# Altium schematic sheet IC_LPDDR4.SchDoc
size 420 x 297 mm; Title1str: Модуль; PageSetup: Record=PageOptions|CenterHorizontal=False|CenterVertical=False|PrintScale=0.95|XCorrection=0.00|YCorrection=0.00|PrintKind=1|BorderSize=5000000|LeftOffset=0|BottomOffset=0|Orientation=1|PaperLength=1000|PaperWidth=1000|Scale=100|PaperSource=15|PrintQuality=600|MediaType=1|DitherType=10|PaperKind=A4|PrintScaleMode=1; Title2str: ATB-LW-USB-GateWay; Mass: ---; Letter1Column: О; Letter2Column: {L}; DocumentType1str: {Документ}; DocumentType2str: {Документ}; SpravNomer: {Справ. №}; Scale: 1:1; DocumentType: Схема электрическая принципиальная; SheetNumber: 13; SheetTotal: 32; DocumentTypeShort: Э3; DocumentInvertoryNumber: ㅤ
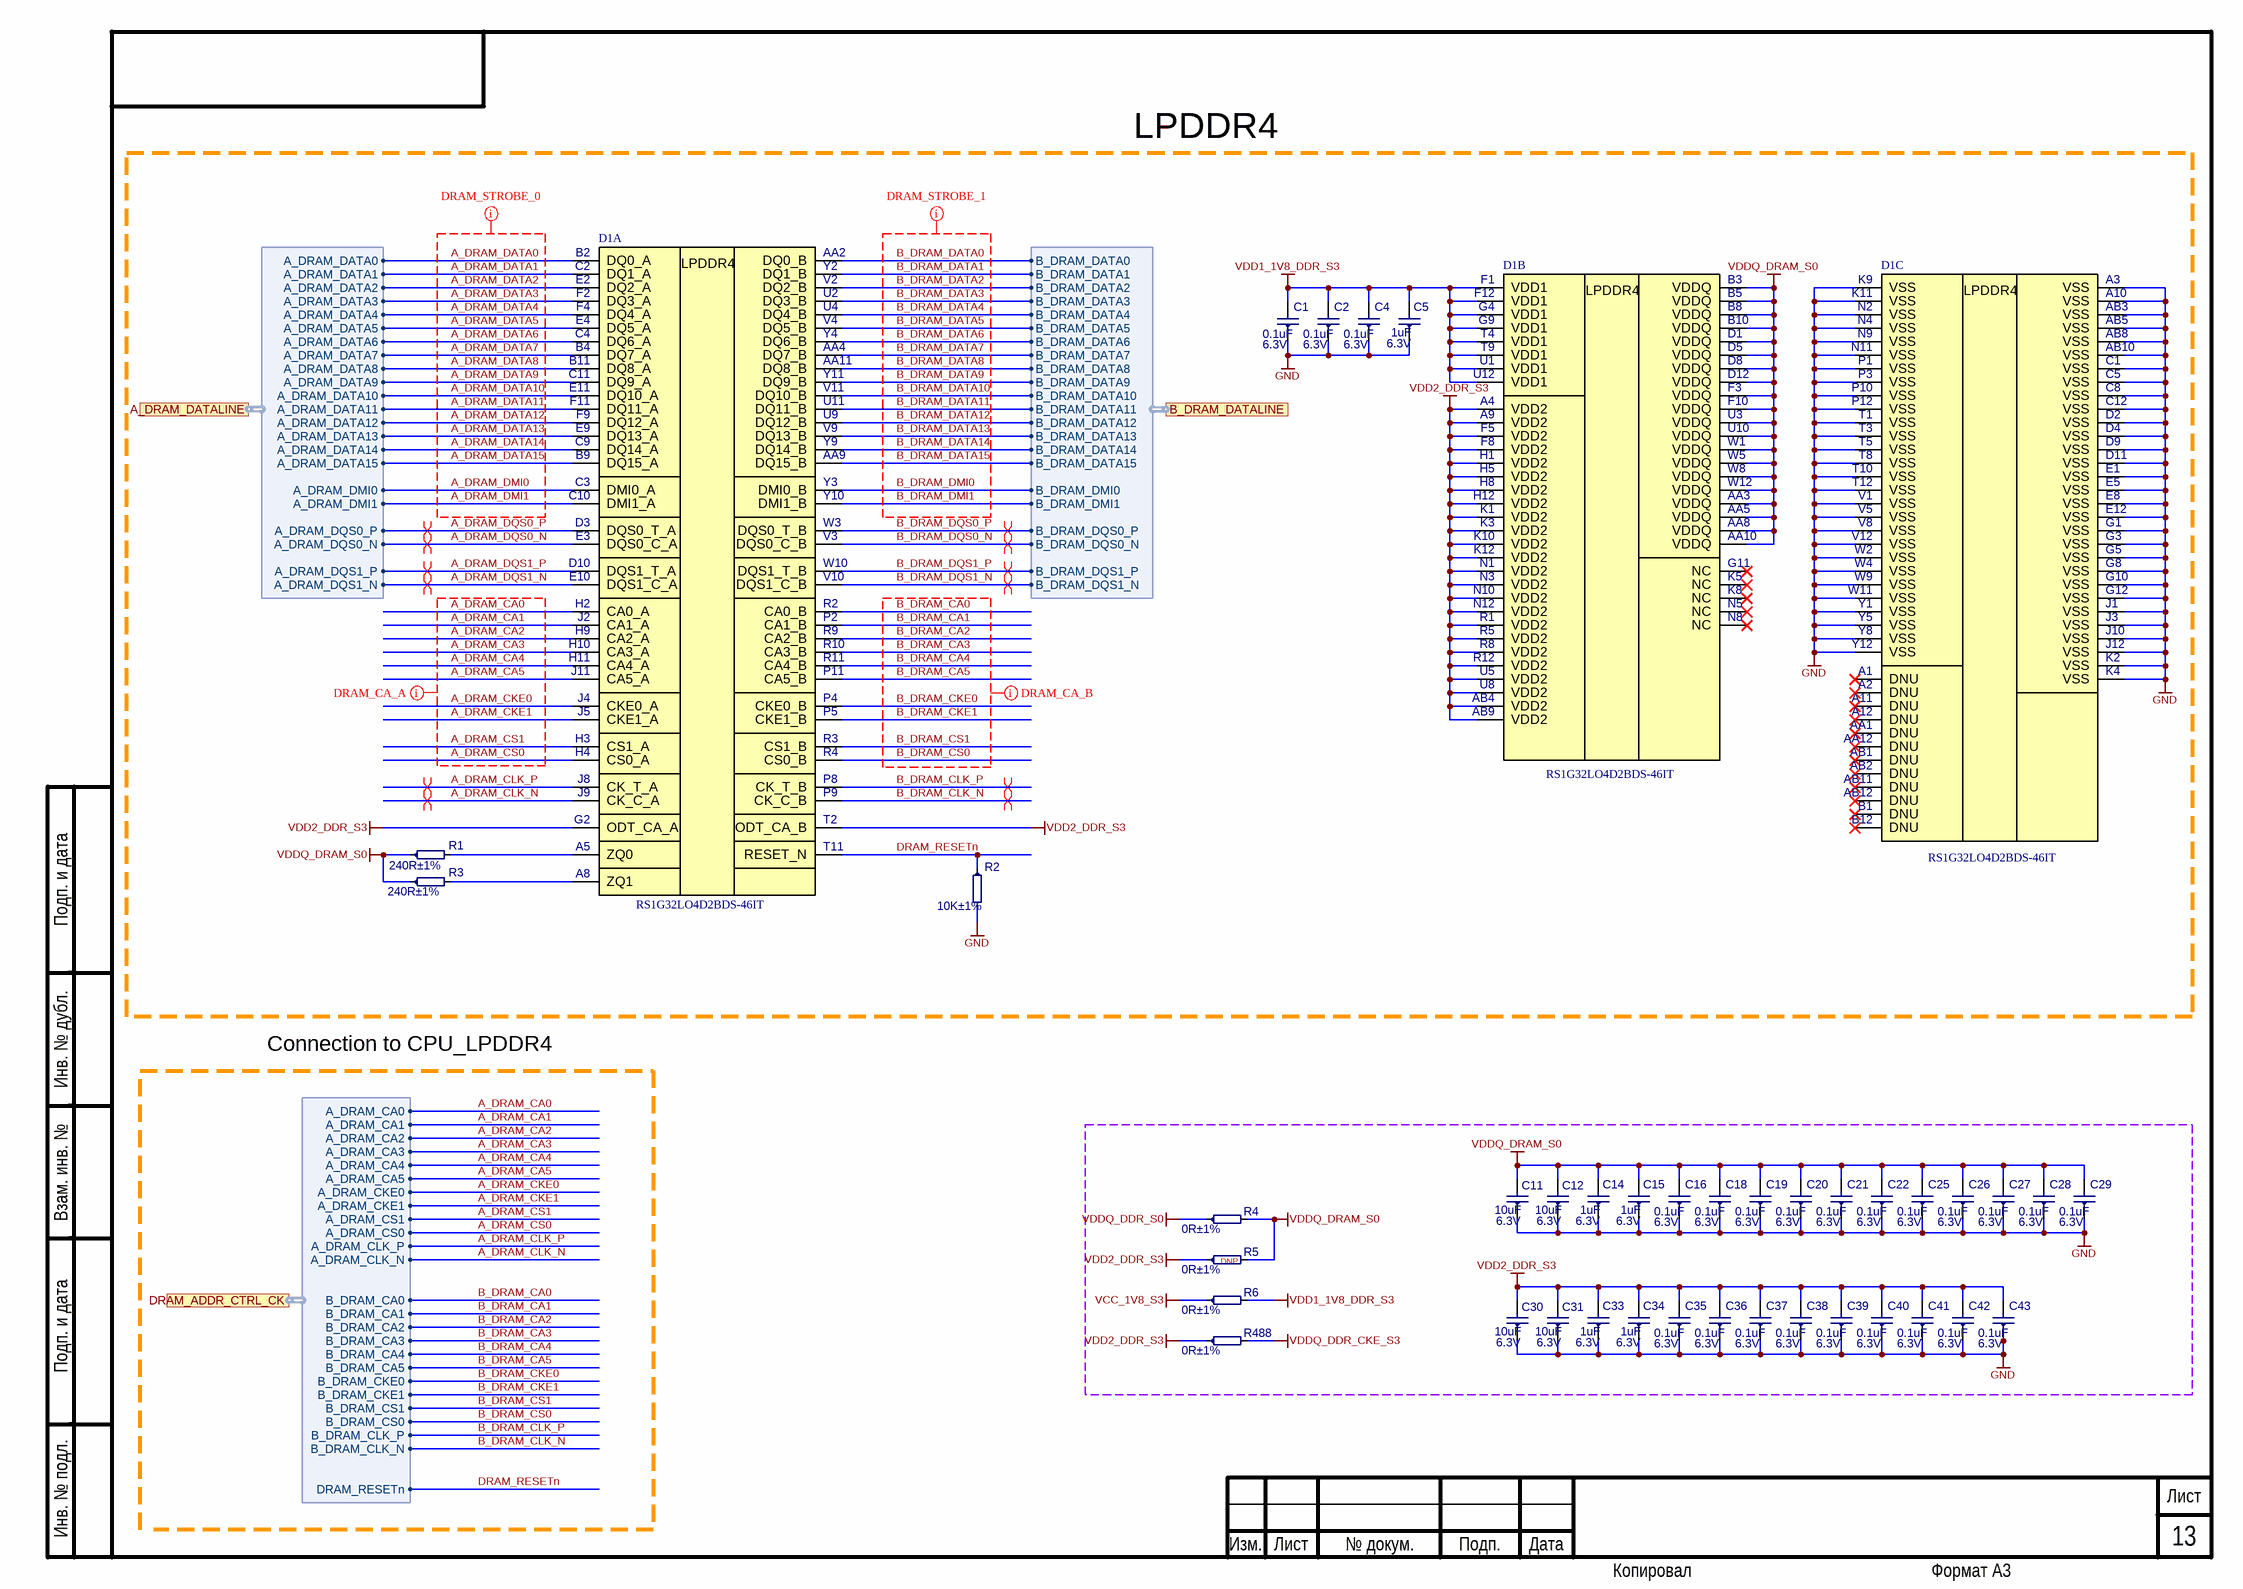
[diagram p0: IC_LPDDR4.SchDoc]

## Parts
C1  0.1uF  Voltage: 6.3V  [C0201]
C2  0.1uF  Voltage: 6.3V  [C0201]
C4  0.1uF  Voltage: 6.3V  [C0201]
C5  1uF  Voltage: 6.3V  [C0201]
C11  10uF  Voltage: 6.3V  [C0402]
C12  10uF  Voltage: 6.3V  [C0402]
C14  1uF  Voltage: 6.3V  [C0201]
C15  1uF  Voltage: 6.3V  [C0201]
C16  0.1uF  Voltage: 6.3V  [C0201]
C18  0.1uF  Voltage: 6.3V  [C0201]
C19  0.1uF  Voltage: 6.3V  [C0201]
C20  0.1uF  Voltage: 6.3V  [C0201]
C21  0.1uF  Voltage: 6.3V  [C0201]
C22  0.1uF  Voltage: 6.3V  [C0201]
C25  0.1uF  Voltage: 6.3V  [C0201]
C26  0.1uF  Voltage: 6.3V  [C0201]
C27  0.1uF  Voltage: 6.3V  [C0201]
C28  0.1uF  Voltage: 6.3V  [C0201]
C29  0.1uF  Voltage: 6.3V  [C0201]
C30  10uF  Voltage: 6.3V  [C0402]
C31  10uF  Voltage: 6.3V  [C0402]
C33  1uF  Voltage: 6.3V  [C0201]
C34  1uF  Voltage: 6.3V  [C0201]
C35  0.1uF  Voltage: 6.3V  [C0201]
C36  0.1uF  Voltage: 6.3V  [C0201]
C37  0.1uF  Voltage: 6.3V  [C0201]
C38  0.1uF  Voltage: 6.3V  [C0201]
C39  0.1uF  Voltage: 6.3V  [C0201]
C40  0.1uF  Voltage: 6.3V  [C0201]
C41  0.1uF  Voltage: 6.3V  [C0201]
C42  0.1uF  Voltage: 6.3V  [C0201]
C43  0.1uF  Voltage: 6.3V  [C0201]
D1  RS1G32LO4D2BDS-46IT  [RS1G32LO4D2BDS-46IT]  (parts A,B,C of 3)
R1  240R±1%  [R0402]
R2  10K±1%  [R0402]
R3  240R±1%  [R0402]
R4  0R±1%  [R0402]
R5  0R±1%  [R0402]
R6  0R±1%  [R0402]
R488  0R±1%  [R0402]

## Ports
A_DRAM_DATALINE (harness A_DRAM_DATALINE), B_DRAM_DATALINE (harness B_DRAM_DATALINE), DRAM_ADDR_CTRL_CK (harness DRAM_ADDR_CTRL_CK)

## Harnesses
A_DRAM_DATALINE: A_DRAM_DATA0, A_DRAM_DATA1, A_DRAM_DATA2, A_DRAM_DATA3, A_DRAM_DATA4, A_DRAM_DATA5, A_DRAM_DATA6, A_DRAM_DATA7, A_DRAM_DATA8, A_DRAM_DATA9, A_DRAM_DATA10, A_DRAM_DATA11, A_DRAM_DATA12, A_DRAM_DATA13, A_DRAM_DATA15, A_DRAM_DATA14, A_DRAM_DMI0, A_DRAM_DMI1, A_DRAM_DQS0_P, A_DRAM_DQS0_N, A_DRAM_DQS1_P, A_DRAM_DQS1_N
B_DRAM_DATALINE: B_DRAM_DATA0, B_DRAM_DATA1, B_DRAM_DATA2, B_DRAM_DATA3, B_DRAM_DATA4, B_DRAM_DATA5, B_DRAM_DATA6, B_DRAM_DATA7, B_DRAM_DATA8, B_DRAM_DATA9, B_DRAM_DATA10, B_DRAM_DATA11, B_DRAM_DATA12, B_DRAM_DATA13, B_DRAM_DATA15, B_DRAM_DATA14, B_DRAM_DMI1, B_DRAM_DMI0, B_DRAM_DQS0_P, B_DRAM_DQS0_N, B_DRAM_DQS1_N, B_DRAM_DQS1_P
DRAM_ADDR_CTRL_CK: B_DRAM_CKE0, B_DRAM_CKE1, B_DRAM_CLK_P, B_DRAM_CS1, A_DRAM_CLK_P, B_DRAM_CA5, A_DRAM_CLK_N, B_DRAM_CA1, B_DRAM_CLK_N, B_DRAM_CA0, B_DRAM_CA2, DRAM_RESETn, B_DRAM_CA3, A_DRAM_CKE1, A_DRAM_CS1, A_DRAM_CA3, A_DRAM_CA5, A_DRAM_CA0, A_DRAM_CS0, A_DRAM_CKE0, A_DRAM_CA4, A_DRAM_CA2, A_DRAM_CA1, B_DRAM_CA4, B_DRAM_CS0

## Nets
GND: C1.1 C2.1 C4.1 C5.1 C11.1 C12.1 C14.1 C15.1 C16.1 C18.1 C19.1 C20.1 C21.1 C22.1 C25.1 C26.1 C27.1 C28.1 C29.1 C30.1 C31.1 C33.1 C34.1 C35.1 C36.1 C37.1 C38.1 C39.1 C40.1 C41.1 C42.1 C43.1 D1.A3(VSS) D1.A10(VSS) D1.AB3(VSS) D1.AB5(VSS) D1.AB8(VSS) D1.AB10(VSS) D1.C1(VSS) D1.C5(VSS) D1.C8(VSS) D1.C12(VSS) D1.D2(VSS) D1.D4(VSS) D1.D9(VSS) D1.D11(VSS) D1.E1(VSS) D1.E5(VSS) D1.E8(VSS) D1.E12(VSS) D1.G1(VSS) D1.G3(VSS) D1.G5(VSS) D1.G8(VSS) D1.G10(VSS) D1.G12(VSS) D1.J1(VSS) D1.J3(VSS) D1.J10(VSS) D1.J12(VSS) D1.K2(VSS) D1.K4(VSS) D1.K9(VSS) D1.K11(VSS) D1.N2(VSS) D1.N4(VSS) D1.N9(VSS) D1.N11(VSS) D1.P1(VSS) D1.P3(VSS) D1.P10(VSS) D1.P12(VSS) D1.T1(VSS) D1.T3(VSS) D1.T5(VSS) D1.T8(VSS) D1.T10(VSS) D1.T12(VSS) D1.V1(VSS) D1.V5(VSS) D1.V8(VSS) D1.V12(VSS) D1.W2(VSS) D1.W4(VSS) D1.W9(VSS) D1.W11(VSS) D1.Y1(VSS) D1.Y5(VSS) D1.Y8(VSS) D1.Y12(VSS) R2.2
VCC_1V8_S3: R6.1
VDD1_1V8_DDR_S3: C1.2 C2.2 C4.2 C5.2 D1.F1(VDD1) D1.F12(VDD1) D1.G4(VDD1) D1.G9(VDD1) D1.T4(VDD1) D1.T9(VDD1) D1.U1(VDD1) D1.U12(VDD1) R6.2
VDD2_DDR_S3: C30.2 C31.2 C33.2 C34.2 C35.2 C36.2 C37.2 C38.2 C39.2 C40.2 C41.2 C42.2 C43.2 D1.A4(VDD2) D1.A9(VDD2) D1.AB4(VDD2) D1.AB9(VDD2) D1.F5(VDD2) D1.F8(VDD2) D1.G2(ODT_CA_A) D1.H1(VDD2) D1.H5(VDD2) D1.H8(VDD2) D1.H12(VDD2) D1.K1(VDD2) D1.K3(VDD2) D1.K10(VDD2) D1.K12(VDD2) D1.N1(VDD2) D1.N3(VDD2) D1.N10(VDD2) D1.N12(VDD2) D1.R1(VDD2) D1.R5(VDD2) D1.R8(VDD2) D1.R12(VDD2) D1.T2(ODT_CA_B) D1.U5(VDD2) D1.U8(VDD2) R5.1 R488.1
VDDQ_DDR_CKE_S3: R488.2
VDDQ_DDR_S0: R4.1
VDDQ_DRAM_S0: C11.2 C12.2 C14.2 C15.2 C16.2 C18.2 C19.2 C20.2 C21.2 C22.2 C25.2 C26.2 C27.2 C28.2 C29.2 D1.AA3(VDDQ) D1.AA5(VDDQ) D1.AA8(VDDQ) D1.AA10(VDDQ) D1.B3(VDDQ) D1.B5(VDDQ) D1.B8(VDDQ) D1.B10(VDDQ) D1.D1(VDDQ) D1.D5(VDDQ) D1.D8(VDDQ) D1.D12(VDDQ) D1.F3(VDDQ) D1.F10(VDDQ) D1.U3(VDDQ) D1.U10(VDDQ) D1.W1(VDDQ) D1.W5(VDDQ) D1.W8(VDDQ) D1.W12(VDDQ) R1.1 R3.1 R4.2 R5.2
A_DRAM_CA0: D1.H2(CA0_A) ; port DRAM_ADDR_CTRL_CK.A_DRAM_CA0
A_DRAM_CA1: D1.J2(CA1_A) ; port DRAM_ADDR_CTRL_CK.A_DRAM_CA1
A_DRAM_CA2: D1.H9(CA2_A) ; port DRAM_ADDR_CTRL_CK.A_DRAM_CA2
A_DRAM_CA3: D1.H10(CA3_A) ; port DRAM_ADDR_CTRL_CK.A_DRAM_CA3
A_DRAM_CA4: D1.H11(CA4_A) ; port DRAM_ADDR_CTRL_CK.A_DRAM_CA4
A_DRAM_CA5: D1.J11(CA5_A) ; port DRAM_ADDR_CTRL_CK.A_DRAM_CA5
A_DRAM_CKE0: D1.J4(CKE0_A) ; port DRAM_ADDR_CTRL_CK.A_DRAM_CKE0
A_DRAM_CKE1: D1.J5(CKE1_A) ; port DRAM_ADDR_CTRL_CK.A_DRAM_CKE1
A_DRAM_CLK_N: D1.J9(CK_C_A) ; port DRAM_ADDR_CTRL_CK.A_DRAM_CLK_N
A_DRAM_CLK_P: D1.J8(CK_T_A) ; port DRAM_ADDR_CTRL_CK.A_DRAM_CLK_P
A_DRAM_CS0: D1.H4(CS0_A) ; port DRAM_ADDR_CTRL_CK.A_DRAM_CS0
A_DRAM_CS1: D1.H3(CS1_A) ; port DRAM_ADDR_CTRL_CK.A_DRAM_CS1
A_DRAM_DATA0: D1.B2(DQ0_A) ; port A_DRAM_DATALINE.A_DRAM_DATA0
A_DRAM_DATA1: D1.C2(DQ1_A) ; port A_DRAM_DATALINE.A_DRAM_DATA1
A_DRAM_DATA2: D1.E2(DQ2_A) ; port A_DRAM_DATALINE.A_DRAM_DATA2
A_DRAM_DATA3: D1.F2(DQ3_A) ; port A_DRAM_DATALINE.A_DRAM_DATA3
A_DRAM_DATA4: D1.F4(DQ4_A) ; port A_DRAM_DATALINE.A_DRAM_DATA4
A_DRAM_DATA5: D1.E4(DQ5_A) ; port A_DRAM_DATALINE.A_DRAM_DATA5
A_DRAM_DATA6: D1.C4(DQ6_A) ; port A_DRAM_DATALINE.A_DRAM_DATA6
A_DRAM_DATA7: D1.B4(DQ7_A) ; port A_DRAM_DATALINE.A_DRAM_DATA7
A_DRAM_DATA8: D1.B11(DQ8_A) ; port A_DRAM_DATALINE.A_DRAM_DATA8
A_DRAM_DATA9: D1.C11(DQ9_A) ; port A_DRAM_DATALINE.A_DRAM_DATA9
A_DRAM_DATA10: D1.E11(DQ10_A) ; port A_DRAM_DATALINE.A_DRAM_DATA10
A_DRAM_DATA11: D1.F11(DQ11_A) ; port A_DRAM_DATALINE.A_DRAM_DATA11
A_DRAM_DATA12: D1.F9(DQ12_A) ; port A_DRAM_DATALINE.A_DRAM_DATA12
A_DRAM_DATA13: D1.E9(DQ13_A) ; port A_DRAM_DATALINE.A_DRAM_DATA13
A_DRAM_DATA14: D1.C9(DQ14_A) ; port A_DRAM_DATALINE.A_DRAM_DATA14
A_DRAM_DATA15: D1.B9(DQ15_A) ; port A_DRAM_DATALINE.A_DRAM_DATA15
A_DRAM_DMI0: D1.C3(DMI0_A) ; port A_DRAM_DATALINE.A_DRAM_DMI0
A_DRAM_DMI1: D1.C10(DMI1_A) ; port A_DRAM_DATALINE.A_DRAM_DMI1
A_DRAM_DQS0_N: D1.E3(DQS0_C_A) ; port A_DRAM_DATALINE.A_DRAM_DQS0_N
A_DRAM_DQS0_P: D1.D3(DQS0_T_A) ; port A_DRAM_DATALINE.A_DRAM_DQS0_P
A_DRAM_DQS1_N: D1.E10(DQS1_C_A) ; port A_DRAM_DATALINE.A_DRAM_DQS1_N
A_DRAM_DQS1_P: D1.D10(DQS1_T_A) ; port A_DRAM_DATALINE.A_DRAM_DQS1_P
B_DRAM_CA0: D1.R2(CA0_B) ; port DRAM_ADDR_CTRL_CK.B_DRAM_CA0
B_DRAM_CA1: D1.P2(CA1_B) ; port DRAM_ADDR_CTRL_CK.B_DRAM_CA1
B_DRAM_CA2: D1.R9(CA2_B) ; port DRAM_ADDR_CTRL_CK.B_DRAM_CA2
B_DRAM_CA3: D1.R10(CA3_B) ; port DRAM_ADDR_CTRL_CK.B_DRAM_CA3
B_DRAM_CA4: D1.R11(CA4_B) ; port DRAM_ADDR_CTRL_CK.B_DRAM_CA4
B_DRAM_CA5: D1.P11(CA5_B) ; port DRAM_ADDR_CTRL_CK.B_DRAM_CA5
B_DRAM_CKE0: D1.P4(CKE0_B) ; port DRAM_ADDR_CTRL_CK.B_DRAM_CKE0
B_DRAM_CKE1: D1.P5(CKE1_B) ; port DRAM_ADDR_CTRL_CK.B_DRAM_CKE1
B_DRAM_CLK_N: D1.P9(CK_C_B) ; port DRAM_ADDR_CTRL_CK.B_DRAM_CLK_N
B_DRAM_CLK_P: D1.P8(CK_T_B) ; port DRAM_ADDR_CTRL_CK.B_DRAM_CLK_P
B_DRAM_CS0: D1.R4(CS0_B) ; port DRAM_ADDR_CTRL_CK.B_DRAM_CS0
B_DRAM_CS1: D1.R3(CS1_B) ; port DRAM_ADDR_CTRL_CK.B_DRAM_CS1
B_DRAM_DATA0: D1.AA2(DQ0_B) ; port B_DRAM_DATALINE.B_DRAM_DATA0
B_DRAM_DATA1: D1.Y2(DQ1_B) ; port B_DRAM_DATALINE.B_DRAM_DATA1
B_DRAM_DATA2: D1.V2(DQ2_B) ; port B_DRAM_DATALINE.B_DRAM_DATA2
B_DRAM_DATA3: D1.U2(DQ3_B) ; port B_DRAM_DATALINE.B_DRAM_DATA3
B_DRAM_DATA4: D1.U4(DQ4_B) ; port B_DRAM_DATALINE.B_DRAM_DATA4
B_DRAM_DATA5: D1.V4(DQ5_B) ; port B_DRAM_DATALINE.B_DRAM_DATA5
B_DRAM_DATA6: D1.Y4(DQ6_B) ; port B_DRAM_DATALINE.B_DRAM_DATA6
B_DRAM_DATA7: D1.AA4(DQ7_B) ; port B_DRAM_DATALINE.B_DRAM_DATA7
B_DRAM_DATA8: D1.AA11(DQ8_B) ; port B_DRAM_DATALINE.B_DRAM_DATA8
B_DRAM_DATA9: D1.Y11(DQ9_B) ; port B_DRAM_DATALINE.B_DRAM_DATA9
B_DRAM_DATA10: D1.V11(DQ10_B) ; port B_DRAM_DATALINE.B_DRAM_DATA10
B_DRAM_DATA11: D1.U11(DQ11_B) ; port B_DRAM_DATALINE.B_DRAM_DATA11
B_DRAM_DATA12: D1.U9(DQ12_B) ; port B_DRAM_DATALINE.B_DRAM_DATA12
B_DRAM_DATA13: D1.V9(DQ13_B) ; port B_DRAM_DATALINE.B_DRAM_DATA13
B_DRAM_DATA14: D1.Y9(DQ14_B) ; port B_DRAM_DATALINE.B_DRAM_DATA14
B_DRAM_DATA15: D1.AA9(DQ15_B) ; port B_DRAM_DATALINE.B_DRAM_DATA15
B_DRAM_DMI0: D1.Y3(DMI0_B) ; port B_DRAM_DATALINE.B_DRAM_DMI0
B_DRAM_DMI1: D1.Y10(DMI1_B) ; port B_DRAM_DATALINE.B_DRAM_DMI1
B_DRAM_DQS0_N: D1.V3(DQS0_C_B) ; port B_DRAM_DATALINE.B_DRAM_DQS0_N
B_DRAM_DQS0_P: D1.W3(DQS0_T_B) ; port B_DRAM_DATALINE.B_DRAM_DQS0_P
B_DRAM_DQS1_N: D1.V10(DQS1_C_B) ; port B_DRAM_DATALINE.B_DRAM_DQS1_N
B_DRAM_DQS1_P: D1.W10(DQS1_T_B) ; port B_DRAM_DATALINE.B_DRAM_DQS1_P
DRAM_RESETn: D1.T11(RESET_N) R2.1 ; port DRAM_ADDR_CTRL_CK.DRAM_RESETn
NetD1_A5: D1.A5(ZQ0) R1.2
NetD1_A8: D1.A8(ZQ1) R3.2

Not connected (* = marked no-connect by the designer): D1 A1(DNU)* A2(DNU)* A11(DNU)* A12(DNU)* AA1(DNU)* AA12(DNU)* AB1(DNU)* AB2(DNU)* AB11(DNU)* AB12(DNU)* B1(DNU)* B12(DNU)* G11(NC)* K5(NC)* K8(NC)* N5(NC)* N8(NC)*

## Layout directives
net class DRAM_STROBE_0: A_DRAM_DATA0, A_DRAM_DATA1, A_DRAM_DATA2, A_DRAM_DATA3, A_DRAM_DATA4, A_DRAM_DATA5, A_DRAM_DATA6, A_DRAM_DATA7, A_DRAM_DATA8, A_DRAM_DATA9, A_DRAM_DATA10, A_DRAM_DATA11, A_DRAM_DATA12, A_DRAM_DATA13, A_DRAM_DATA14, A_DRAM_DATA15, A_DRAM_DMI0, A_DRAM_DMI1
net class DRAM_STROBE_1: B_DRAM_DATA0, B_DRAM_DATA1, B_DRAM_DATA2, B_DRAM_DATA3, B_DRAM_DATA4, B_DRAM_DATA5, B_DRAM_DATA6, B_DRAM_DATA7, B_DRAM_DATA8, B_DRAM_DATA9, B_DRAM_DATA10, B_DRAM_DATA11, B_DRAM_DATA12, B_DRAM_DATA13, B_DRAM_DATA14, B_DRAM_DATA15, B_DRAM_DMI0, B_DRAM_DMI1
net class DRAM_CA_B: B_DRAM_CA0, B_DRAM_CA1, B_DRAM_CA2, B_DRAM_CA3, B_DRAM_CA4, B_DRAM_CA5, B_DRAM_CKE0, B_DRAM_CKE1, B_DRAM_CS0, B_DRAM_CS1
differential pair; differential pair class A_DRAM_CLK: A_DRAM_CLK_P
differential pair; differential pair class B_DRAM_CLK: B_DRAM_CLK_P
differential pair: A_DRAM_CLK_N, A_DRAM_DQS0_N, A_DRAM_DQS1_N, B_DRAM_CLK_N, B_DRAM_DQS0_N, B_DRAM_DQS1_N
differential pair; differential pair class DRAM_STROBE0_B_Diff: B_DRAM_DQS0_P
differential pair; differential pair class DRAM_STROBE1_B_Diff: B_DRAM_DQS1_P
differential pair; differential pair class DRAM_STROBE0_A_Diff: A_DRAM_DQS0_P
differential pair; differential pair class DRAM_STROBE1_A_Diff: A_DRAM_DQS1_P
net class DRAM_CA_A: A_DRAM_CA0, A_DRAM_CA1, A_DRAM_CA2, A_DRAM_CA3, A_DRAM_CA4, A_DRAM_CA5, A_DRAM_CKE0, A_DRAM_CKE1, A_DRAM_CS0, A_DRAM_CS1

## Notes on the sheet
- LPDDR4
- Connection to CPU_LPDDR4
- (near R5) DNP
- Подп. и дата
- Инв. № дубл.
- Взам. инв. №
- Инв. № подл.
- Изм.
- Лист
- № докум.
- Подп.
- Дата
- Копировал
- Формат А3
- (in symbol RS1G32LO4D2BDS-46IT, part A) LPDDR4
- (in symbol RS1G32LO4D2BDS-46IT, part B) LPDDR4
- (in symbol RS1G32LO4D2BDS-46IT, part C) LPDDR4

## Library data of the parts
C1 C2 C4 C16 C18-C22 C25-C29 C35-C43 = 0201-X5R-6.3V-0.1uF±10%: Manufacturer: Yageo; NameFromManufacturer: CC0201KRX5R5BB104; Dielectric: X5R; Place: *); Tolerance: 10%; Check: False; Case: C0201; Part Number: 0201-X5R-6.3V-0.1uF±10%; Value: 0.1uF; Temperature: -55°C~85°C; ComponentLink2Description: Link to datasheet; ComponentLink1Description: DATASHEET; ComponentLink2URL: https://www.terraelectronica.ru/product/1020032; ComponentLink1URL: Datasheets/capacitors/UPY-GPHC_X5R_4V-to-50V_27.pdf; Last changed: 27.10.2022
C5 C14 C15 C33 C34 = 0201-X5R-6.3V-1uF±20%: Manufacturer: Murata Electronics; NameFromManufacturer: GRM033R60J105MEA2D; Dielectric: X5R; Place: *); Tolerance: 20%; Check: False; Case: C0201; Part Number: 0201-X5R-6.3V-1uF±20%; Value: 1uF; Temperature: -55°C~85°C; ComponentLink2Description: Link to datasheet; ComponentLink1Description: DATASHEET; ComponentLink2URL: https://www.terraelectronica.ru/product/1209278; ComponentLink1URL: Datasheets/capacitors/GRM033R60J105MEA2-61A.pdf; Last changed: 27.10.2022
C11 C12 C30 C31 = 0402-X5R-6.3V-10uF±20%: Manufacturer: Yageo; NameFromManufacturer: CC0402MRX5R5BB106; Dielectric: X5R; Place: *); Tolerance: 20%; Check: False; Case: C0402; Part Number: 0402-X5R-6.3V-10uF±20%; Value: 10uF; Temperature: -55°C~125°C; ComponentLink2Description: Link to datasheet; ComponentLink1Description: DATASHEET; ComponentLink2URL: https://ru.mouser.com/ProductDetail/YAGEO/CC0402MRX5R5BB106?qs=%2Fha2pyFadujQAk9rG2cgJj8l7IbODD3KVaDjvxAcKzu9LtlLnRlq6Q%3D%3D; ComponentLink1URL: Datasheets/capacitors/UPY-GPHC_X5R_4V-to-50V_27.pdf; Last changed: 27.10.2022
D1 = RS1G32LO4D2BDS-46IT: DDR4 SDRAM емкостью 32 Гбит с организацией 1024М x 32 бит; Manufacturer: Rayson; Check: False; Part Number: RS1G32LO4D2BDS-46IT; NameFromManufacturer: RS1G32LO4D2BDS-46IT; Value: RS1G32LO4D2BDS-46IT
R1 R3 = 0402-0.0625W-240R-100ppm±1%: NameFromManufacturer: RC0402FR-07240RL; Manufacturer: Yageo; Place: *); Value: 240R; Tolerance: 1%; Check: False; Case: R0402; Part Number: 0402-0.0625W-240R-100ppm±1%; Temperature: -55°C~155°C; ComponentLink1Description: DATASHEET; ComponentLink1URL: https://www.terraelectronica.ru/product/870661; Datasheet: Datasheets/resistors/PYu-RC_Group_51_RoHS_L_11.pdf; Last changed: 27.10.2022
R2 = 0402-0.0625W-10K-100ppm±1%: Chip Resistor 0402 10kΩ ±1% 50V ±100ppm/℃ Thick Film; NameFromManufacturer: RC0402FR-0710KL; Manufacturer: Yageo; Place: *); Value: 10K; Check: False; Case: R0402; Part Number: 0402-0.0625W-10K-100ppm±1%; Tolerance: 1%; Temperature: -55°C~155°C; ComponentLink1Description: DATASHEET; ComponentLink1URL: https://ru.mouser.com/ProductDetail/YAGEO/RC0402FR-0710KL?qs=%2Fha2pyFaduhjtLcYvKXQ8IogF7YwN7YtH%252BOO8ZtEEMnoa4yoWYcwpw%3D%3D; Datasheet: Datasheets/resistors/PYu-RC_Group_51_RoHS_L_11.pdf; Last changed: 27.10.2022
R4-R6 R488 = 0402-0.0625W-0R-100ppm±1%: Chip Resistor 0402 0Ω ±1% 50V ±100ppm/℃ Thick Film; NameFromManufacturer: RC0402FR-070RL; Manufacturer: Yageo; Place: *); Value: 0R; Check: False; Case: R0402; Part Number: 0402-0.0625W-0R-100ppm±1%; Tolerance: 1%; Temperature: -55°C~155°C; ComponentLink1Description: DATASHEET; ComponentLink1URL: https://www.chipdip.ru/product0/8000617426?ysclid=l7og5x0plo427794326; Datasheet: Datasheets/resistors/DOC012445956.pdf; Last changed: 27.10.2022